# EAGLE design schematic (EAGLE 8.6.3)
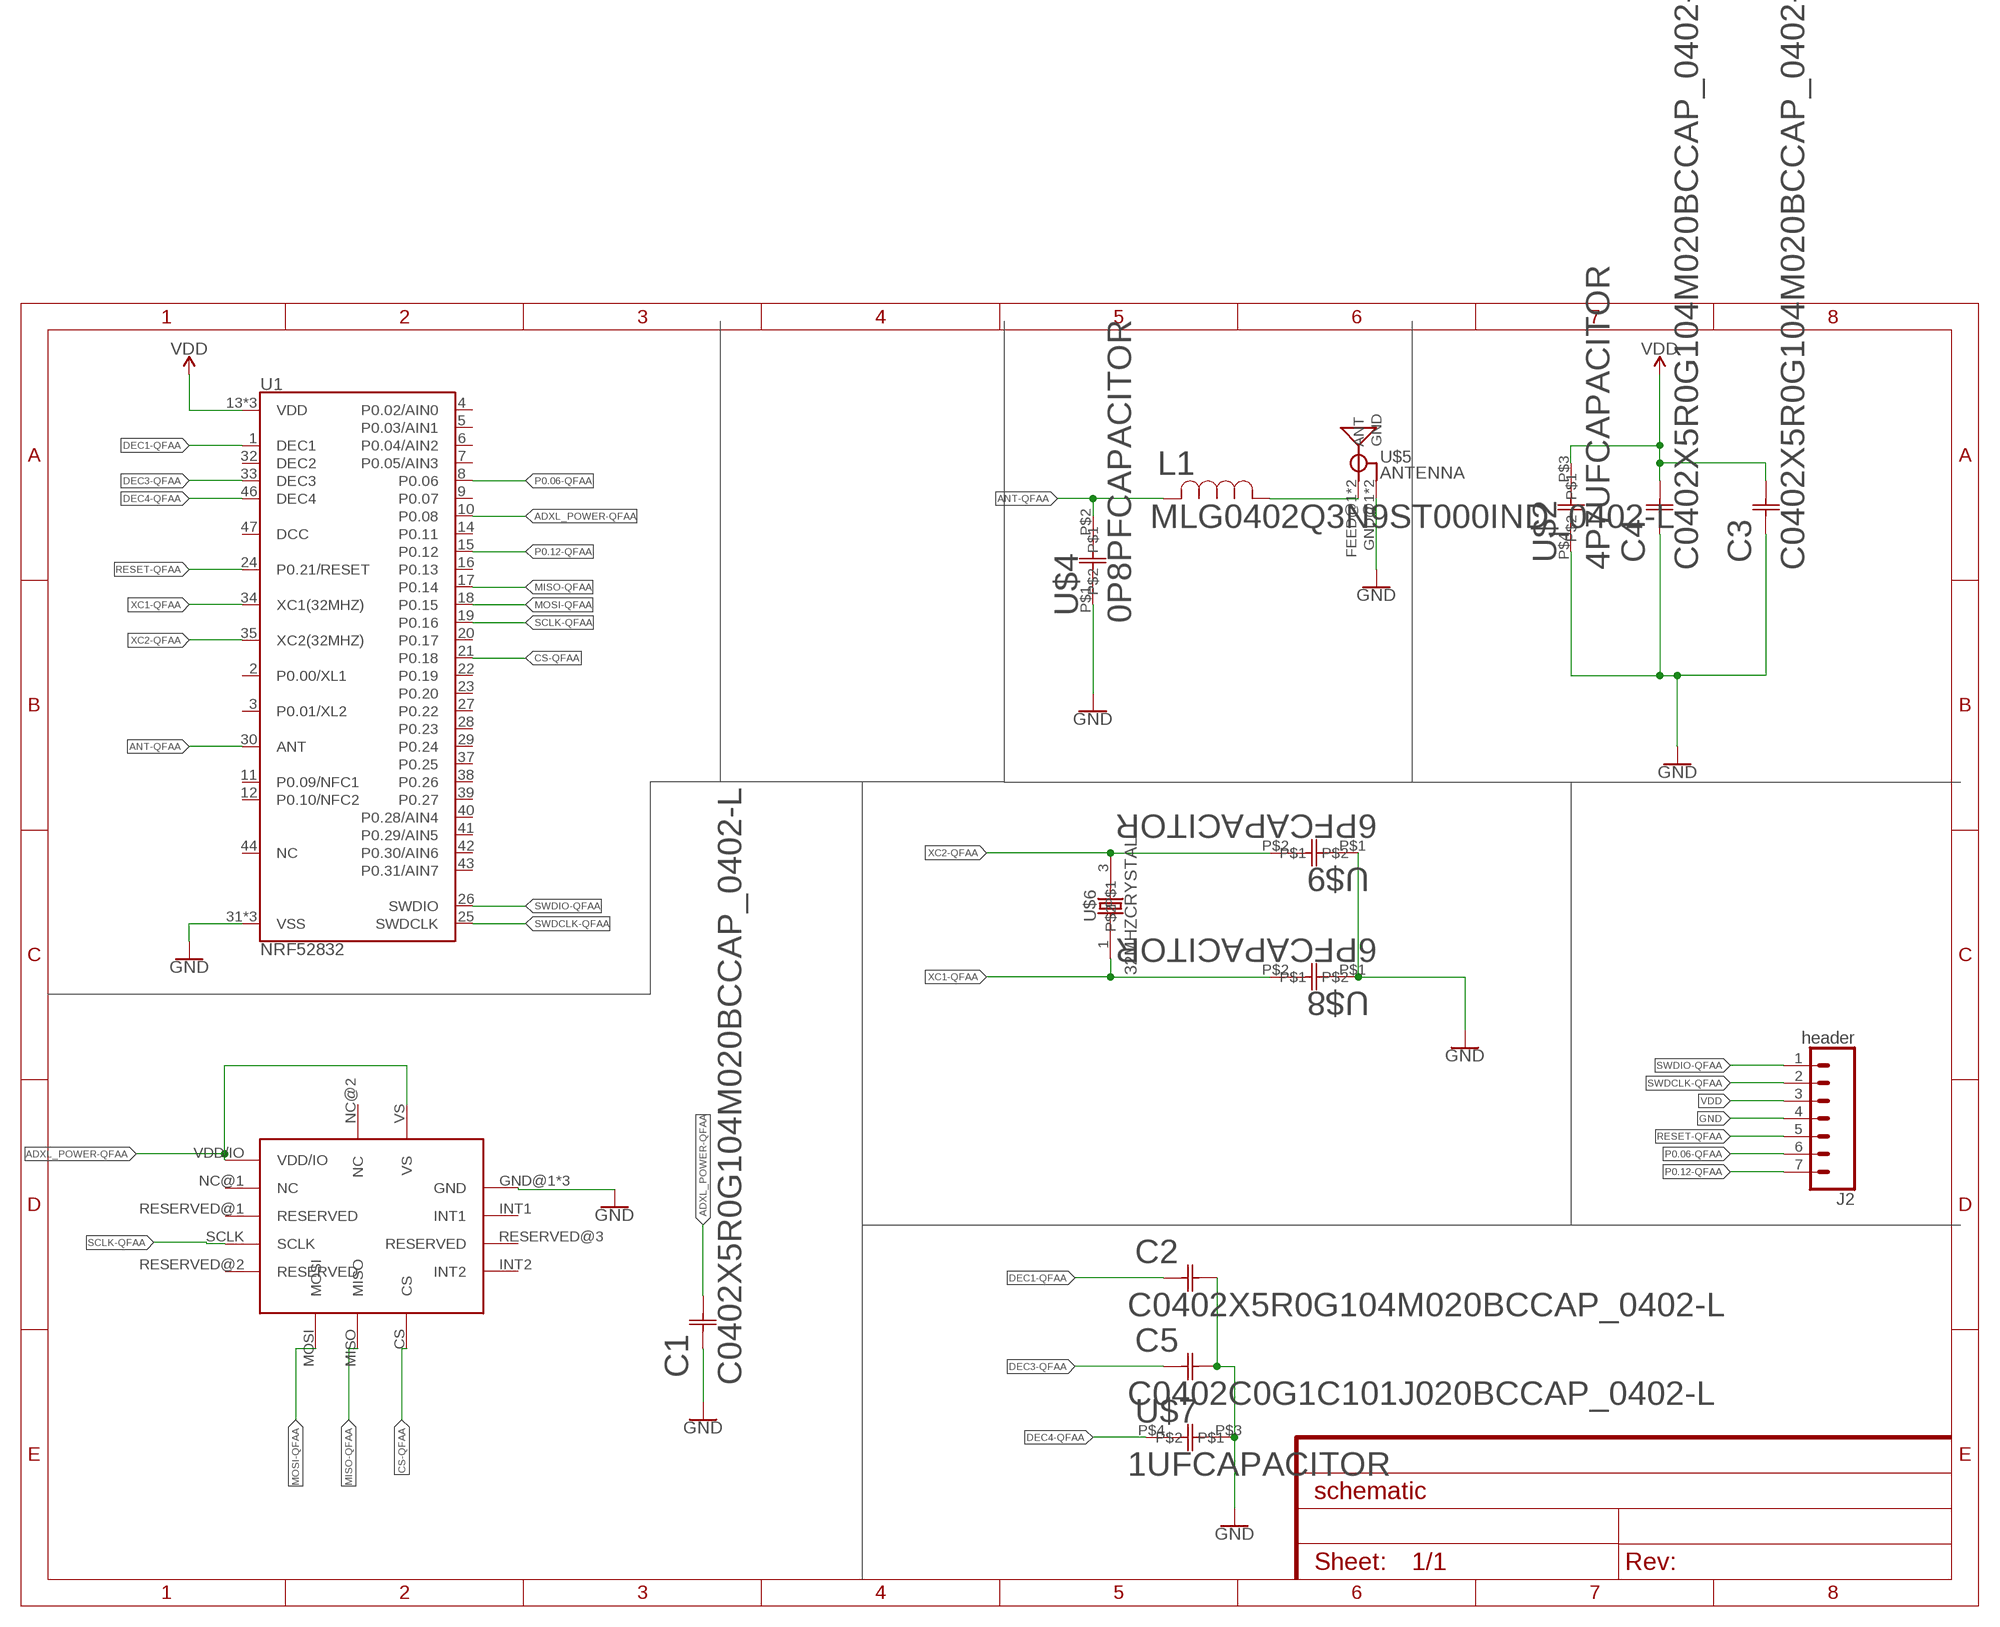
[diagram p0: schematic, sheet 1]

## Parts
C1  C0402X5R0G104M020BCCAP_0402-L  [CAP_0402-L]
C2  C0402X5R0G104M020BCCAP_0402-L  [CAP_0402-L]
C3  C0402X5R0G104M020BCCAP_0402-L  [CAP_0402-L]
C4  C0402X5R0G104M020BCCAP_0402-L  [CAP_0402-L]
C5  C0402C0G1C101J020BCCAP_0402-L  [CAP_0402-L]
J2  header  CONN_07  [1X07]
L1  MLG0402Q3N9ST000IND_0402-L  [IND_0402-L]
U1  NRF52832  [QFN48-6X6MM]
U$1  ADXL362  [TFLGA-16/3.3MMX3.1MM]
U$2  4P7UFCAPACITOR  [4P7UFCAPACITOR]
U$4  0P8PFCAPACITOR  [0P8PFCAPACITOR]
U$5  ANTENNA  [ANTENNA_FOOTPRINT]
U$6  32MHZCRYSTAL  [32MHZCRYSTAL]
U$7  1UFCAPACITOR  [1UFCAPACITOR]
U$8  6PFCAPACITOR  [6PFCAPACITOR]
U$9  6PFCAPACITOR  [6PFCAPACITOR]

## Nets
ADXL_POWER-QFAA: C1.2 U1.10(P0.08) U$1.VDD/IO U$1.VS
ANT-QFAA: L1.2 U1.30(ANT) U$4.P$2
CS-QFAA: U1.21(P0.18) U$1.CS
DEC1-QFAA: C2.1 U1.1(DEC1)
DEC3-QFAA: C5.1 U1.33(DEC3)
DEC4-QFAA: U1.46(DEC4) U$7.P$4
GND: C1.1 C2.2 C3.1 C4.1 C5.2 J2.4 U1.31(VSS) U1.45(VSS) U1.EP(VSS) U$1.GND@1(GND) U$1.GND@2(GND) U$1.GND@3(GND) U$2.P$4 U$4.P$1 U$5.GND@1(GND) U$5.GND@2(GND) U$7.P$3 U$8.P$1 U$9.P$1
MISO-QFAA: U1.17(P0.14) U$1.MISO
MOSI-QFAA: U1.18(P0.15) U$1.MOSI
N$1: L1.1 U$5.FEED@1(ANT) U$5.FEED@2(ANT)
P0.06-QFAA: J2.6 U1.8(P0.06)
P0.12-QFAA: J2.7 U1.15(P0.12)
RESET-QFAA: J2.5 U1.24(P0.21/RESET)
SCLK-QFAA: U1.19(P0.16) U$1.SCLK
SWDCLK-QFAA: J2.2 U1.25(SWDCLK)
SWDIO-QFAA: J2.1 U1.26(SWDIO)
VDD: C3.2 C4.2 J2.3 U1.13(VDD) U1.36(VDD) U1.48(VDD) U$2.P$3
XC1-QFAA: U1.34(XC1(32MHZ)) U$6.1 U$8.P$2
XC2-QFAA: U1.35(XC2(32MHZ)) U$6.3 U$9.P$2
Unconnected: U1.2(P0.00/XL1) U1.3(P0.01/XL2) U1.4(P0.02/AIN0) U1.5(P0.03/AIN1) U1.6(P0.04/AIN2) U1.7(P0.05/AIN3) U1.9(P0.07) U1.11(P0.09/NFC1) U1.12(P0.10/NFC2) U1.14(P0.11) U1.16(P0.13) U1.20(P0.17) U1.22(P0.19) U1.23(P0.20) U1.27(P0.22) U1.28(P0.23) U1.29(P0.24) U1.32(DEC2) U1.37(P0.25) U1.38(P0.26) U1.39(P0.27) U1.40(P0.28/AIN4) U1.41(P0.29/AIN5) U1.42(P0.30/AIN6) U1.43(P0.31/AIN7) U1.44(NC) U1.47(DCC) U$1.INT1 U$1.INT2 U$1.NC@1(NC) U$1.NC@2(NC) U$1.RESERVED@1(RESERVED) U$1.RESERVED@2(RESERVED) U$1.RESERVED@3(RESERVED)

## Library data of the parts
C1-C4 = 0p1_uF_capacitor:C0402X5R0G104M020BC; MANUFACTURER_PART_NUMBER: C0402C0G1C101J020BC; VENDOR: TDK
C5 = 100_pF_capacitor:C0402C0G1C101J020BC; MANUFACTURER_PART_NUMBER: C0402C0G1C101J020BC; VENDOR: TDK
J2 = SparkFun-Connectors:CONN_07: Multi connection point. Often used as Generic Header-pin footprint for 0.1 inch spaced/style header connections On any of the 0.1 inch spaced packages, you can populate with these: Break Away Headers - Straight <https://www.sparkfun.com/products/116> (PRT-00116) Break Away Male Headers - Right Angle <https://www.sparkfun.com/products/553> (PRT-00553) Female Headers <https://www.sparkfun.com/products/115> (PRT-00115) Break Away Headers - Machine Pin <https://www.sparkfun.com/products/117> (PRT-00117) Break Away Female Headers - Swiss Machine Pin <https://www.sparkfun.com/products/743> (PRT-00743) For SCREWTERMINALS and SPRING TERMINALS visit here: Screw Terimnals on SparkFun.com <https://www.sparkfun.com/search/results?term=Screw+Terminals> (5mm/3.5mm/2.54mm spacing) This device is also useful as a general connection point to wire up your design to another part of your project. Our various solder wires solder well into these plated through hole pads. Hook-Up Wire - Assortment (Stranded, 22 AWG) <https://www.sparkfun.com/products/11375> (PRT-11375) Hook-Up Wire - Assortment (Solid Core, 22 AWG) <https://www.sparkfun.com/products/11367> (PRT-11367) View the entire wire category on our website here <https://www.sparkfun.com/categories/141> Special notes: Molex polarized connector foot print use with SKU : PRT-08231 with associated crimp pins and housings. 1MM SMD Version SKU: PRT-10208 NOTES ON THE VARIANTS LOCK and LOCK_LONGPADS... This footprint was designed to help hold the alignment of a through-hole component (i.e. 6-pin header) while soldering it into place. You may notice that each hole has been shifted either up or down by 0.005 of an inch from it's more standard position (which is a perfectly straight line). This slight alteration caused the pins (the squares in the middle) to touch the edges of the holes. Because they are alternating, it causes a "brace" to hold the component in place. 0.005 has proven to be the perfect amount of "off-center" position when using our standard breakaway headers. Although looks a little odd when you look at the bare footprint, once you have a header in there, the alteration is very hard to notice. Also,if you push a header all the way into place, it is covered up entirely on the bottom side.
L1 = 3p9_nH_inductor:MLG0402Q3N9ST000; MANUFACTURER_PART_NUMBER: MLG0402Q3N9ST000; VENDOR: TDK
U1 = nrf52832-breakout-temp:NRF52832: Nordic nRF52832 Bluetooth Smart/ANT/2.4GHz RF SoC The nRF52832 SoC is a powerful, highly flexible ultra-low power multiprotocol SoC ideally suited for Bluetooth® Smart ANT and 2.4GHz ultra low-power wireless applications. The nRF52832 SoC is built around a 32-bit ARM® Cortex™-M4F CPU with 512kB + 64kB RAM. The embedded 2.4GHz transceiver supports Bluetooth Smart, ANT and proprietary 2.4 GHz protocol stack. It is on air compatible with the nRF51 Series, nRF24L and nRF24AP Series products from Nordic Semiconductor. Product Page <https://www.nordicsemi.com/eng/Products/Bluetooth-low-energy2/nRF52832>; PROD_ID: IC-13460
U$1 = ADXL362:ADXL362
U$2 = 4p7_uF_capacitor:4P7UFCAPACITOR
U$4 = 0p8_pF_capacitor:0P8PFCAPACITOR
U$5 = 2p4_ghz_antenna:ANTENNA
U$6 = 32_mhz_crystal:32MHZCRYSTAL
U$7 = 1_uF_capacitor:1UFCAPACITOR
U$8 U$9 = 6_pF_capacitor:6PFCAPACITOR

## Board
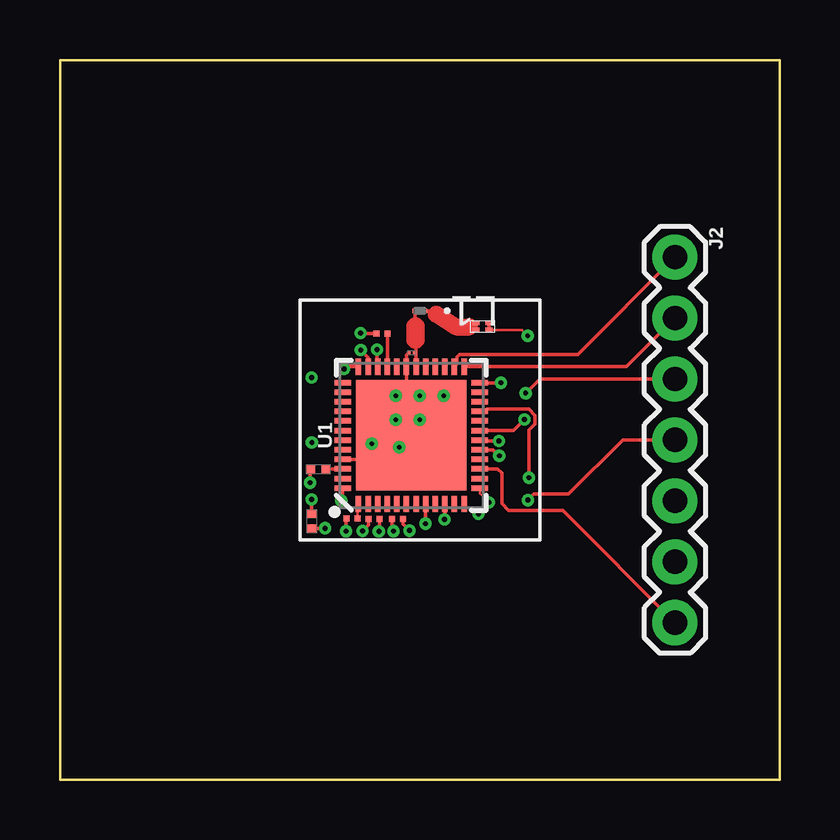
[diagram p1: board, top side]
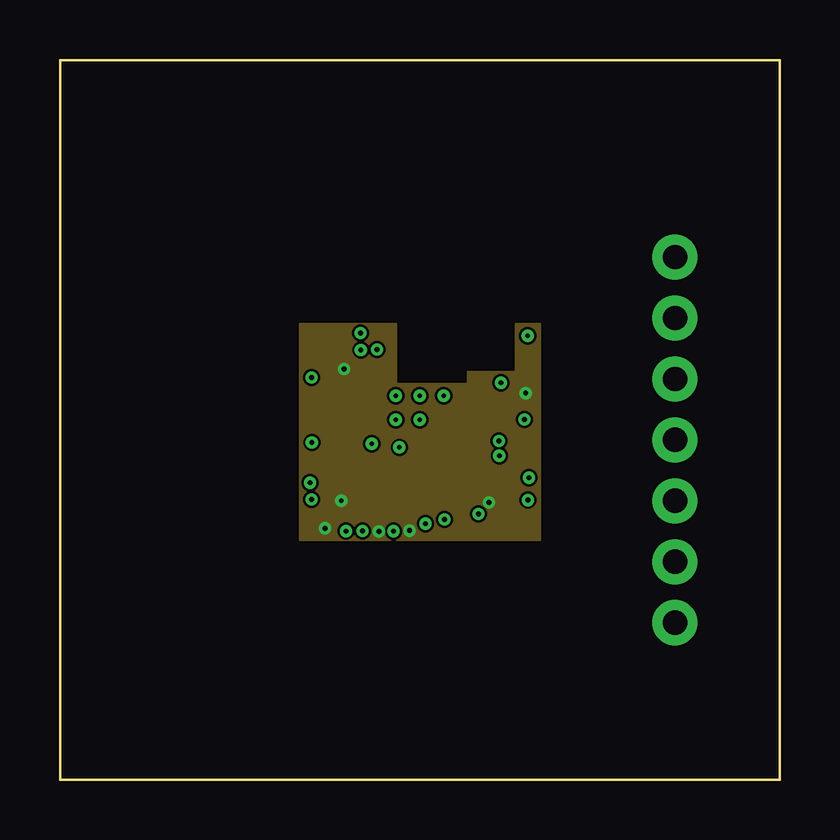
[diagram p2: board, inner layer Route8]
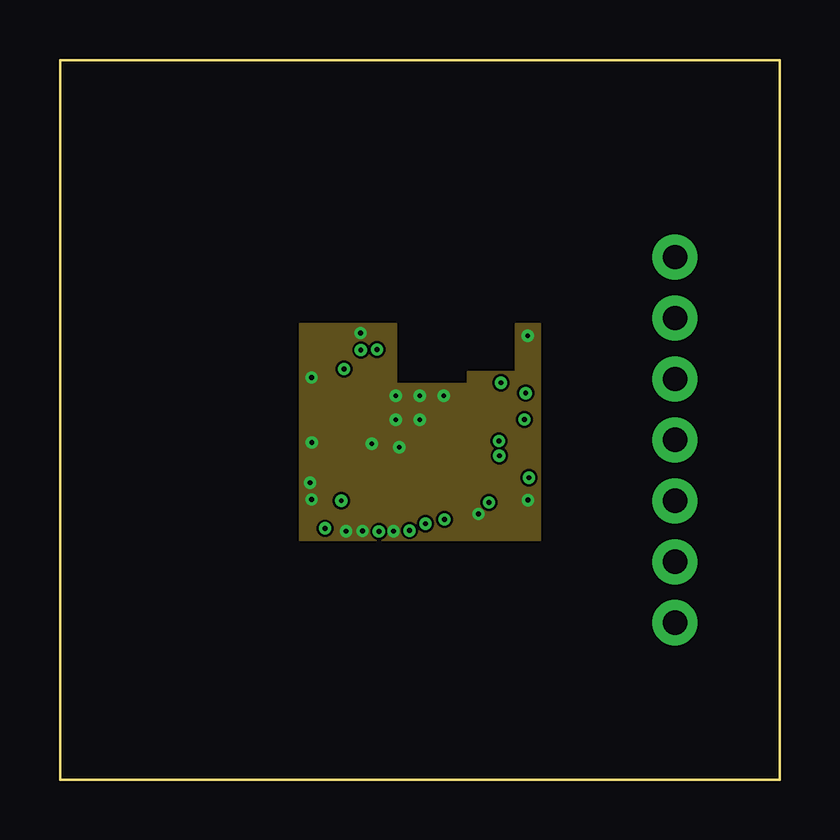
[diagram p3: board, inner layer Route10]
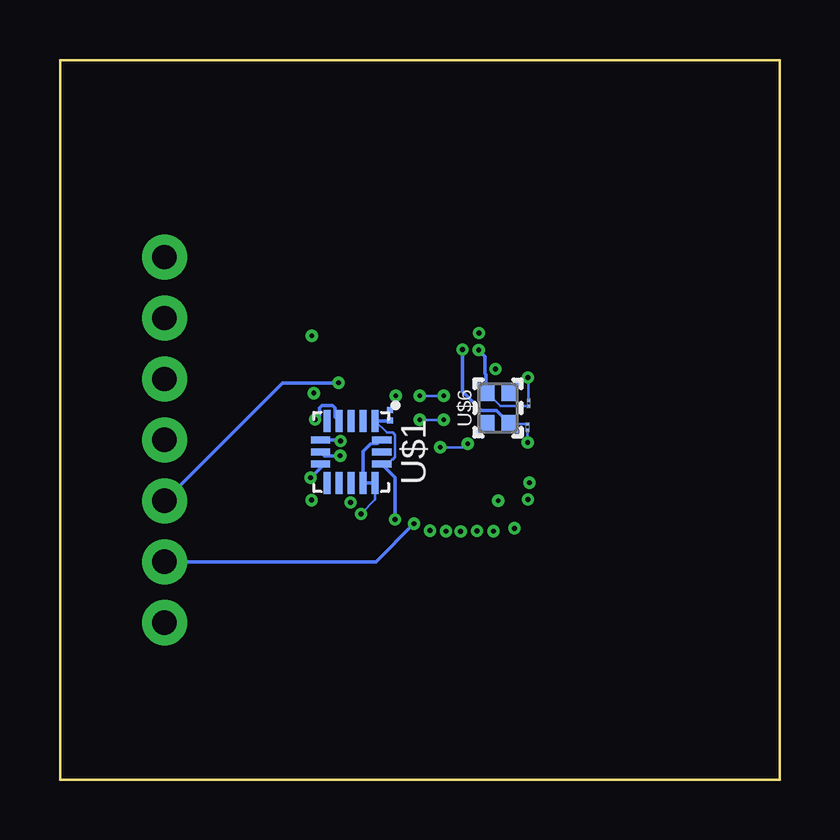
[diagram p4: board, bottom side, seen from below]

Size 30 x 30 mm. Coordinates in mm from the lower left corner, seen from the top.
Outline: 0,0 30,0 30,30 0,30 0,0
Copper layers (((1*4)*8*10)*(12*16)): Top 0.035mm / dielectric 1.5mm / Route4 0.035mm / dielectric 0.15mm / Route8 0.035mm / dielectric 0.15mm / Route10 0.035mm / dielectric 0.15mm / Route12 0.035mm / dielectric 0.15mm / Bottom 0.035mm
Design rules "default *": minimum track width 4mil, minimum drill 8mil, track to track 4mil, track to pad 4mil, pad to pad 4mil, via to via 4mil, smd to smd 2mil, copper to edge 40mil, drill to drill 6mil, minimum pad ring 10mil, minimum via ring 6mil, stop-mask expansion 4mil, vias tented up to drill 0mil, thermal gap 10mil

### Footprints (pad centres in the part's own frame; a part is rotated, then mirrored left to right if it is on the bottom)
CAP_0402-L = smd 0.25 x 0.25: 1 -0.229,0; 2 0.229,0
1X07 = drill 1.016 pad 1.88: 1 0,0; 2 2.54,0; 3 5.08,0; 4 7.62,0; 5 10.16,0; 6 12.7,0; 7 15.24,0
IND_0402-L = smd 0.212 x 0.2: 1 -0.196,0; 2 0.196,0
QFN48-6X6MM = smd 0.68 x 0.23: 1 -2.86,2.2; 2 -2.86,1.8; 3 -2.86,1.4; 4 -2.86,1; 5 -2.86,0.6; 6 -2.86,0.2; 7 -2.86,-0.2; 8 -2.86,-0.6; 9 -2.86,-1; 10 -2.86,-1.4; 11 -2.86,-1.8; 12 -2.86,-2.2; 25 2.86,-2.2; 26 2.86,-1.8; 27 2.86,-1.4; 28 2.86,-1; 29 2.86,-0.6; 30 2.86,-0.2; 31 2.86,0.2; 32 2.86,0.6; 33 2.86,1; 34 2.86,1.4; 35 2.86,1.8; 36 2.86,2.2 | smd 0.23 x 0.68: 13 -2.2,-2.86; 14 -1.8,-2.86; 15 -1.4,-2.86; 16 -1,-2.86; 17 -0.6,-2.86; 18 -0.2,-2.86; 19 0.2,-2.86; 20 0.6,-2.86; 21 1,-2.86; 22 1.4,-2.86; 23 1.8,-2.86; 24 2.2,-2.86; 37 2.2,2.86; 38 1.8,2.86; 39 1.4,2.86; 40 1,2.86; 41 0.6,2.86; 42 0.2,2.86; 43 -0.2,2.86; 44 -0.6,2.86; 45 -1,2.86; 46 -1.4,2.86; 47 -1.8,2.86; 48 -2.2,2.86 | smd 4.6 x 4.6: EP 0,0
TFLGA-16/3.3MMX3.1MM = smd 0.3 x 0.8: CS 0.5,-1.275; GND@3 -0.5,1.275; MISO 0,-1.275; MOSI -0.5,-1.275; NC@2 0,1.275; VS 0.5,1.275 | smd 0.925 x 0.3: GND@1 1.288,0.5; GND@2 1.288,1; INT1 1.288,0; INT2 1.288,-1; NC@1 -1.288,0.5; RESERVED@1 -1.288,0; RESERVED@2 -1.288,-1; RESERVED@3 1.288,-0.5; SCLK -1.288,-0.5; VDD/IO -1.288,1
4P7UFCAPACITOR = smd 0.35 x 0.4: P$3 0.18,0.15; P$4 0.8,0.15
0P8PFCAPACITOR = smd 0.125 x 0.15: P$1 0.034,0.075; P$2 0.27,0.075
ANTENNA_FOOTPRINT = smd 0.3 x 0.2: FEED@1 0.77,0.1; FEED@2 0.77,0.4; GND@1 0.23,0.1; GND@2 0.23,0.4
32MHZCRYSTAL = smd 0.75 x 0.7: 1 0.485,0.47; 2 1.835,0.47; 3 1.835,1.47; 4 0.485,1.47
1UFCAPACITOR = smd 0.35 x 0.4: P$3 0.18,0.15; P$4 0.8,0.15
6PFCAPACITOR = smd 0.125 x 0.15: P$1 0.034,0.075; P$2 0.27,0.075

### Placement (x,y rotation side)
C1  16.24,15.19 270 bottom
C2  12.19,10.88 180 top
C3  14.07,10.87 0 top
C4  13.09,10.87 0 top
C5  13.42,18.6 180 top
J2  25.64,21.78 270 top
L1  15,19.54 180 top
U1  14.65,14.35 90 top
U$1  17.86,13.66 270 bottom
U$2  10.65,10.28 90 top
U$4  14.52,17.72 0 top
U$5  18.11,19.14 180 top
U$6  10.77,14.33 90 bottom
U$7  10.27,12.79 0 top
U$8  10.43,14.54 90 bottom
U$9  10.53,15.83 270 bottom

### Tracks (layer width: path | path; a pad name or v marks a point on that pad's centre or on a via)
ADXL_POWER-QFAA  (via drill 0.2)
  Top 0.152: U1.10 16.05,10.86 v16.03,10.84
  Bottom 0.102: 16.46,13.04 16.15,13.35 16.12,13.35 16.03,13.44 16.03,14.37 16.12,14.46 16.37,14.46 U$1.VDD/IO
  Bottom 0.152: U$1.VDD/IO 16.25,14.94 C1.2 | v16.03,10.84 16.03,12.6 16.46,13.04 U$1.VS
ANT-QFAA
  Top 0.102: U$4.P$2 14.8,17.8 14.85,17.8
  Top 0.152: U1.30 14.85,17.8 | 14.85,17.8 14.84,17.81 14.84,17.83 | 14.82,18.35 14.9,18.29 14.85,18.23 14.85,17.8 | 14.82,18.89 L1.2
  Top 0.762: 14.82,18.35 14.82,18.89
CS-QFAA  (via drill 0.2 pad 0.51)
  Top 0.152: v19.55,12.58 19.55,14.58 19.8,14.83 19.8,15.19 19.54,15.44 17.81,15.44 17.72,15.35 U1.21
  Bottom 0.152: v19.55,12.58 19.13,13 U$1.CS
DEC1-QFAA
  Top 0.102: U1.1 12.41,11.46 C2.1
DEC3-QFAA
  Top 0.152: C5.1 13.65,18.12 13.65,18.11 13.65,17.75 13.65,17.74 U1.33
DEC4-QFAA
  Top 0.152: U$7.P$4 11.78,12.94 U1.46
GND  (via drill 0.2, 0.2 pad 0.51)
  Top 0.102: 14.45,16.75 14.45,16.55 v15,16 | v14,16 v14,15 | v14,15 v15,15 | v14,15 v13,14 | U$5.GND@2 19.26,18.74 v19.5,18.5 | U$4.P$1 14.45,17.69
  Top 0.152: U1.31 14.45,16.75 14.45,14.55 U1.EP v14.15,13.85 13.65,13.35 U1.45 | U$7.P$3 10.42,12.91 v10.42,12.38 | C2.2 11.92,10.85 v11.92,10.36 | C5.2 12.54,18.6 v12.53,18.61 | C4.1 12.86,10.61 v12.61,10.37 | U$2.P$4 v10.5,11.67 | C3.1 13.84,10.42 v13.9,10.35 | v19.52,11.65 19.76,11.9 21.2,11.9 23.46,14.16 J2.4 | 14.39,17.33 U1.31 | U$5.GND@1 U$5.GND@2 | U1.31 14.45,17.69 14.52,17.76 14.53,17.8
  Bottom 0.102: U$9.P$1 10.46,16.73 v10.49,16.76 | U$8.P$1 v10.5,14.06 | v15,16 v14,16 | v15,15 v14,15 | v13,14 13.15,13.85 v14.15,13.85 | U$1.GND@3 16.76,13.98 17.06,13.98 | U$1.GND@2 16.86,11.67 v17.45,11.08
  Bottom 0.152: 10.48,16.78 v10.49,16.76 | v10.5,14.06 v10.5,14.05 | C1.1 16,15.65 v16,16 | 17.06,13.98 17.36,13.68 U$1.GND@1 U$1.GND@2
  pour Route10: 10,10 20,10 20,19 19,19 19,17 17,17 17,16.5 14,16.5 14,19 10,19
MISO-QFAA  (via drill 0.2 pad 0.51)
  Top 0.152: v18.31,13.5 18.14,13.68 18.12,13.68 18.05,13.75 U1.17
  Bottom 0.152: U$1.MISO 18.98,13.5 v18.31,13.5
MOSI-QFAA  (via drill 0.2 pad 0.51)
  Top 0.152: v18.3,14.11 17.55,14.11 U1.18
  Bottom 0.152: U$1.MOSI 18.35,14.16 v18.3,14.11
N$1
  Top 0.152: U$5.FEED@2 17.34,18.82 | 17.34,18.82 U$5.FEED@1 | L1.1 15.55,19.54 15.69,19.4 | 17.07,18.87 17.29,18.87 17.34,18.82
  Top 0.711: 15.69,19.4 16.52,18.87 17.07,18.87
P0.06-QFAA  (via drill 0.2 pad 0.51)
  Top 0.152: v15.24,10.67 v15.25,10.67 U1.8
  Bottom 0.152: J2.6 16.83,9.08 v15.24,10.67
P0.12-QFAA
  Top 0.152: J2.7 20.96,11.22 19.34,11.22 19.33,11.23 18.7,11.23 18.42,11.5 18.42,12.78 18.25,12.95 U1.15
RESET-QFAA  (via drill 0.2 pad 0.51)
  Top 0.152: v18.39,16.54 U1.24
  Bottom 0.152: J2.5 20.72,16.54 v18.39,16.54
SCLK-QFAA  (via drill 0.2 pad 0.51)
  Top 0.152: U1.19 18.91,14.55 v19.36,15.01
  Bottom 0.152: v19.36,15.01 19.19,15.18 19.19,15.48 19.08,15.58 18.63,15.58 18.53,15.48 18.53,15.12 U$1.SCLK
SWDCLK-QFAA
  Top 0.152: J2.2 23.61,17.21 U1.25
SWDIO-QFAA
  Top 0.152: U1.26 16.55,17.32 16.55,17.62 16.66,17.73 21.59,17.73 J2.1
VDD  (via drill 0.2, 0.2 pad 0.51)
  Top 0.102: U1.13 17.51,11.93 v17.88,11.55
  Top 0.152: U1.48 11.79,11.68 v11.73,11.62 | U1.36 11.94,17.21 v11.85,17.11 | C4.2 13.31,10.37 v13.29,10.35 | U$2.P$3 11.05,10.46 v11.06,10.48 | C3.2 14.29,10.66 v14.58,10.38 | J2.3 20.01,16.7 v19.42,16.11
  Route8 0.152: v11.73,11.62 v11.73,11.63
  pour Route8: 10,10 20,10 20,19 19,19 19,17 17,17 17,16.5 14,16.5 14,19 10,19
XC1-QFAA  (via drill 0.2 pad 0.51)
  Top 0.152: v13.22,17.93 13.22,17.23 U1.34
  Bottom 0.102: U$8.P$2 U$6.1
  Bottom 0.152: U$6.1 11.8,15.38 12.43,15.38 13.22,16.18 v13.22,17.93
XC2-QFAA  (via drill 0.2 pad 0.51)
  Top 0.152: v12.54,17.91 12.85,17.6 U1.35
  Bottom 0.102: U$9.P$2 11.63,15.56 U$6.3
  Bottom 0.152: U$6.3 12.24,16.89 12.28,16.93 12.28,17.64 v12.54,17.91